# Altium schematic sheet AC-input-and-line-filter.SchDoc
size A4; SheetNumber: 3; SheetTotal: 4
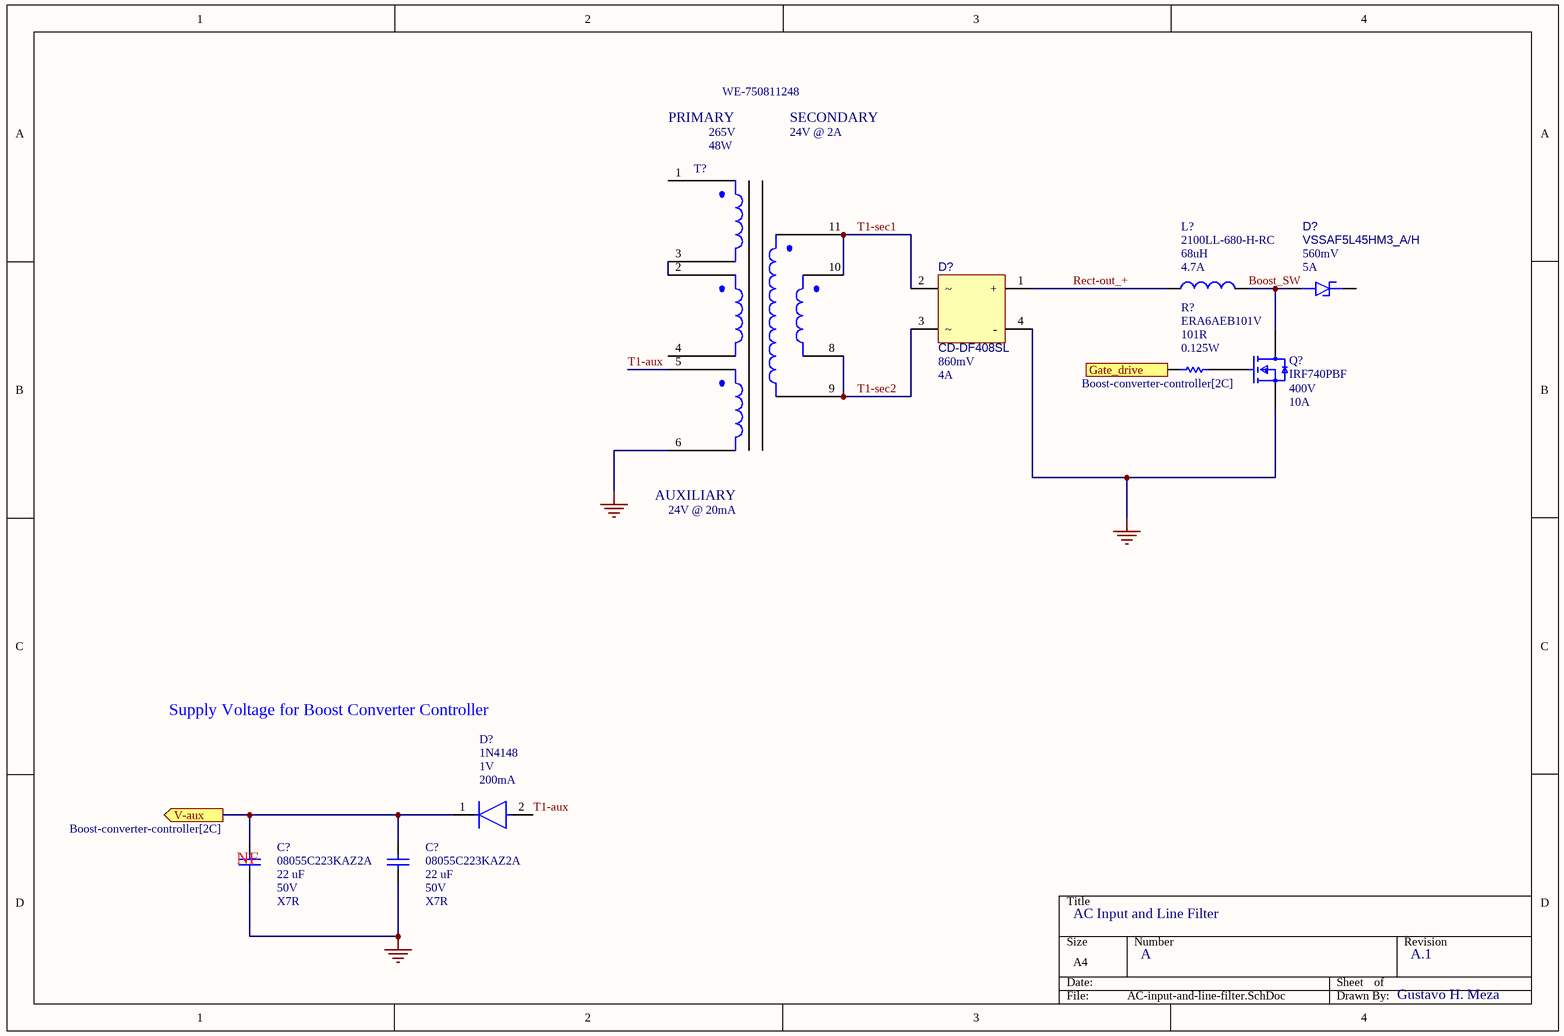
[diagram p0: AC-input-and-line-filter.SchDoc]

## Parts
(Parts that share a designator on the sheet are numbered #1, #2 ... from top to bottom, then left to right.)
C?#1  08055C223KAZ2A  Capacitance: 22 uF  Voltage rating: 50V  Dieleectric: X7R  [CAPC2013X94X50ML20T25]
C?#2  08055C223KAZ2A  Capacitance: 22 uF  Voltage rating: 50V  Dieleectric: X7R  [CAPC2013X94X50ML20T25]
D?#1  VSSAF5L45HM3_A/H  Forward Current: 5A  Forward Voltage: 560mV  [VSSAF5L45HM3_A_H-Footprint-1]
D?#2  CD-DF408SL  Forward Voltage: 860mV  Forward Current: 4A  [CD-DF408SL-Footprint-1]
D?#3  1N4148  Forward Voltage: 1V  Output Current: 200mA  [FP-017AG-MFG]
L?  2100LL-680-H-RC  Inductance-Nom (L): 68uH  Max Current Rating: 4.7A  [2100LL-680-H-RC-Footprint-1]
Q?  IRF740PBF  Drain To Source Voltage: 400V  Continuous Drain Current: 10A  [FP-X15-0364-MFG]
R?  ERA6AEB101V  Resistance: 101R  Power rating: 0.125W  [RESC2013X60X40ML20T25]
T?  WE-750811248  Power: 48W  Voltage Rating: 265V  Auxiliary winding voltage: 24V @ 20mA  Secondary winding voltage: 24V @ 2A  [WE-750811248-Footprint-1]

## Ports
Gate_drive (in, see Boost-converter-controller[2C]), V-aux (out, see Boost-converter-controller[2C])

## Nets
GND: C?#1.1 C?#2.1 D?#2.4(-) Q?.3(S) T?.6
Boost_SW: D?#1.2(A) L?.2 Q?.2(D)
Gate_drive: R?.1 ; port Gate_drive
Rect-out_+: D?#2.1(+) L?.1
T1-aux: D?#3.2(A) T?.5
T1-sec1: D?#2.2 T?.10 T?.11
T1-sec2: D?#2.3 T?.8 T?.9
V-aux: C?#1.2 C?#2.2 D?#3.1(C) ; port V-aux
NetQ?_1: Q?.1(G) R?.2
NetT?_2: T?.2 T?.3

Not connected (* = marked no-connect by the designer): D?#1 1(K); T? 1 4

## Notes on the sheet
- PRIMARY
- SECONDARY
- (near T?) AUXILIARY
- Supply Voltage for Boost Converter Controller
- (near C?#1) NF
- AC Input and Line Filter
- A
- A.1
- Gustavo H. Meza

## Library data of the parts
C?#1 C?#2 = CMP-2007-04398-1: Manufacturer: AVX Interconnect / Elco; Part Number: 08055C223KAZ2A
D?#1 = CMP-004-00033-2: Diode Schottky 45V 5A DO221AC; Diode Element Material: SILICON; Diode Type: RECTIFIER; Application(s): EFFICIENCY; Min Operating Temperature: -40°C; Max Operating Temperature: 150°C; Pins: 2; RoHS Compliant: Yes
D?#2 = CMP-004-00034-1: Bridge Rectifier Diode, 1 Phase, 4A, 800V V(RRM), Silicon; Max Surge Current: 150A; Reach SVHC Compliant: No; Min Operating Temperature: -55°C; Max Operating Temperature: 175°C; RoHS Compliant: Yes; Mounting Technology: Flat; JESD-609 Code: e3; Diode Type: RECTIFIER
D?#3 = CMP-07163-000046-1: DIODE GEN PURP 100V 200MA DO35; Max Power Dissipation: 500mW; Max Reverse Current: 5uA; Forward Current: 300mA; Current: 4A; Reverse Recovery Time: 4ns; Element Configuration: Single; Outside Diameter: 1.85mm; Capacitance: 4pF; Polarity: Standard; Max Forward Surge Current (Ifsm): 1A; Reverse Voltage: 100V; Average Rectified Current: 200mA; Diameter: 1.91mm; Max Repetitive Reverse Voltage (Vrrm): 100V; Current Rating: 200mA; Case/Package: DO-35; Lead Free: Lead Free; Number of Pins: 2; Recovery Time: 4ns; Packaging: Bulk; Contact Plating: Tin; Voltage: 100V; Mount: Through Hole; Max Surge Current: 4A; Package Quantity: 2000; Width: 1.91mm; Max Reverse Voltage (DC): 100V; Length: 4.56mm; Radiation Hardening: No; Power Dissipation: 500mW; Voltage Rating (DC): 100V; Peak Non-Repetitive Surge Current: 4A; REACH SVHC: No SVHC; Height: 4.56mm; Max Operating Temperature: 175°C; Series: -; Weight: 0.01lb; Min Operating Temperature: -65°C
L? = CMP-006-00025-1: General Purpose Inductor, 68uH, 15%, 1 Element; Inductor Application: HIGH CURRENT INDUCTOR; DC Resistance (DCR): 30mR; Construction: Horizontal Mounting; RoHS Compliant: Yes; Tolerance: 15%; Max Operating Temperature: 125°C; Pins: 2; Min Operating Temperature: -55°C
Q? = CMP-02550-000088-1: MOSFET N-CH 400V 10A TO-220AB; Manufacturer: Vishay; Power Dissipation: 125W; Turn On Delay Time: 14ns; Standoff Height: 3.33mm; Max Junction Temp: +150°C; Number Of Channels: 1; Reverse Recovery Charge: 3800nC; Turn Off Delay Time: 50ns; Threshold Vgs Min: 2V; Input Capacitace At Vds: 1400pF @ 25V; Depletion Mode: False; Gate Charge At Vgs: 63nC @ 10V; Rthja Max: 62°C/W; Threshold Vgs Max: 4V; Gate To Source Voltage: 20V; Pulse Drain Current: 40A; Reverse Recovery Time: 370ns; Drain To Source Resistance: 0.55Ω; Temperature Range Low: -55°C; Mouser Description: MOSFET N-Chan 400V 10 Amp; Package: X15-0364; RoHS: TRUE; Manufacturer Part Number: IRF740PBF; Category: Trans; Drain To Source Breakdown Voltage: 400V; Device Class L3: MOSFETs; Lead Free: Yes; Height: 19.89mm; Octopart: https://octopart.com/irf740pbf-vishay-46527100; Automotive: No; Max Forward Diode Voltage: 2V; Device Class L1: Discrete Semiconductors; ComponentLink2URL: http://www.vishay.com/docs/91054/91054.pdf; Temperature Range High: +150°C; Device Class L2: Transistors; ComponentLink2Description: Datasheet; Temperature: -55°C to +150°C; Number Of N Channels: 1; Digikey Description: MOSFET N-CH 400V 10A TO-220AB
R? = CMP-2001-00580-1: Manufacturer: Panasonic; Part Number: ERA6AEB101V
T? = CMP-012-00000-1: Power Transformers MID-L3798/99 Offline Isol 3.6uH +-10%; Inductance: 300uH; Turns Ratio: 0.167372; Min Operating Temperature: -40°C; Mounting Technology: THT; Max Operating Temperature: 125°C; Pins: 10; RoHS Compliant: Yes